# Altium project Magnetorquer.PrjPcb
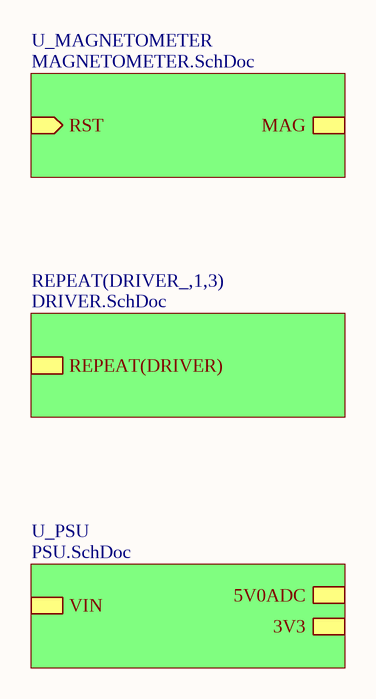
[diagram p0: TOP.SchDoc]
3 sheets, 20 parts. Net scope: hierarchical (ports join the sheet entries above them; power ports are global).
Sheets:
  TOP.SchDoc
    U_MAGNETOMETER = MAGNETOMETER.SchDoc
    DRIVER_1 = DRIVER.SchDoc
    DRIVER_2 = DRIVER.SchDoc
    DRIVER_3 = DRIVER.SchDoc

## Sheet TOP.SchDoc
size A; SheetNumber: 1; SheetTotal: 4

### Sub-sheets
REPEAT(DRIVER_,1,3) = DRIVER.SchDoc: REPEAT(DRIVER) (harness DRIVER)
U_MAGNETOMETER = MAGNETOMETER.SchDoc: RST (in), MAG (harness MAGNETOMETER)
U_PSU = PSU.SchDoc (file not in this document): VIN, 5V0ADC, 3V3

## Sheet MAGNETOMETER.SchDoc
size A; SheetNumber: 3; SheetTotal: 4
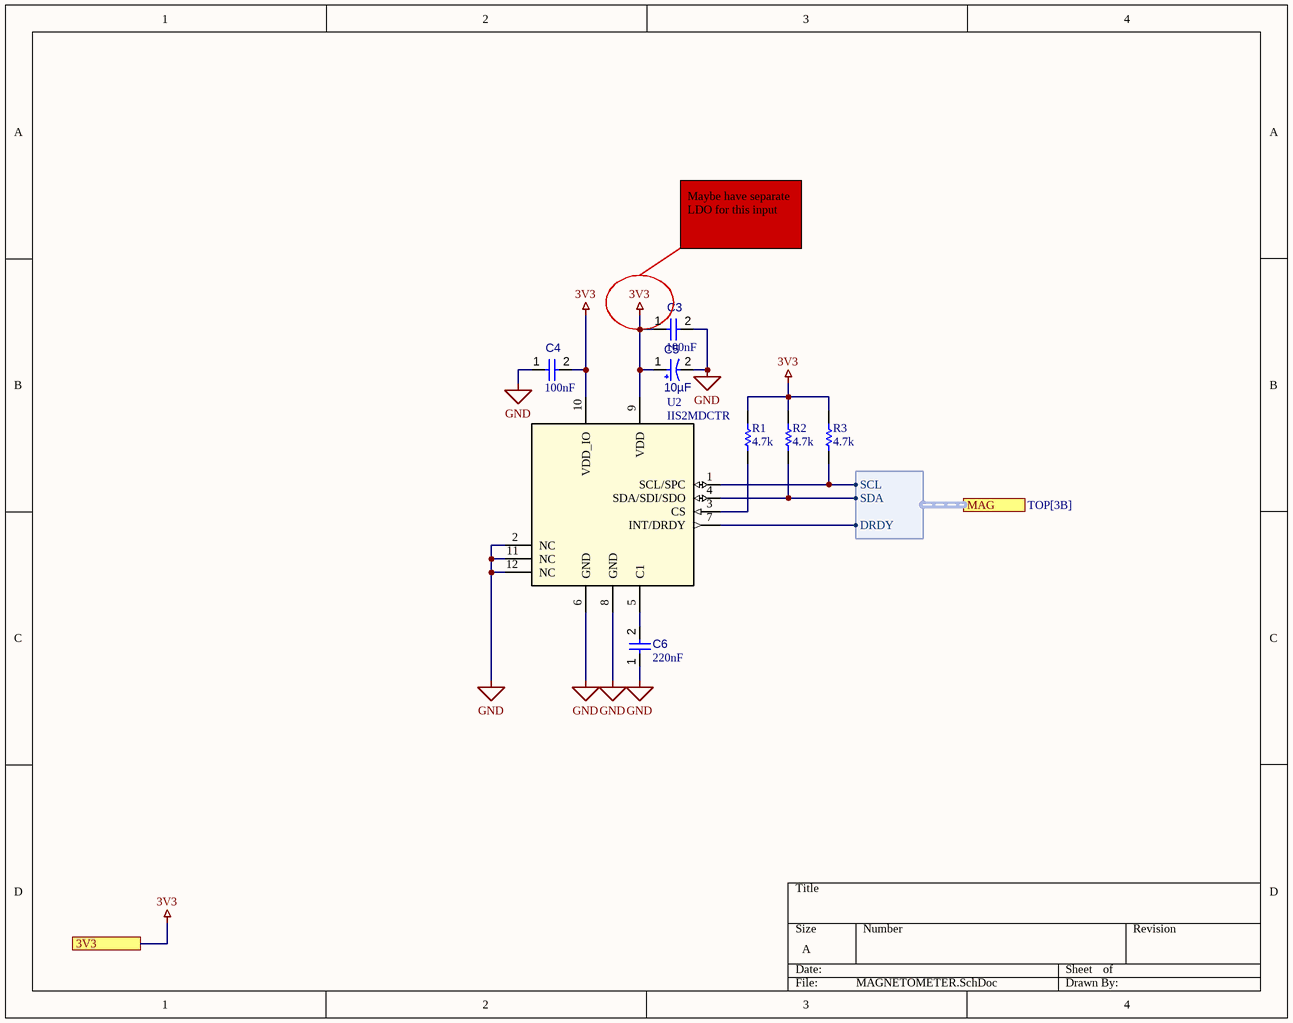
[diagram p1: MAGNETOMETER.SchDoc]

### Parts
C3  value 100nF  [CAPC1005X56X25LL10T15]  (hidden comment: Capacitor 0.1 uF +/- 5% 16 V 0402)
C4  value 100nF  [CAPC1005X56X25LL10T15]  (hidden comment: Capacitor 0.1 uF +/- 5% 16 V 0402)
C5  10µF
C6  value 220nF  [CAPC0402(1005)60_L]  (hidden comment: Capacitor 220nF +/-20% 10V 0402)
R1  value 4.7k  [RESC1005X40X25ML05T05]  (hidden comment: Resistor 4k7 +/-1% 0402 100 mW)
R2  value 4.7k  [RESC1005X40X25ML05T05]  (hidden comment: Resistor 4k7 +/-1% 0402 100 mW)
R3  value 4.7k  [RESC1005X40X25ML05T05]  (hidden comment: Resistor 4k7 +/-1% 0402 100 mW)
U2  IIS2MDCTR  [LGA-12_2X2X0P7_STM]

### Ports
3V3, MAG (harness MAGNETOMETER, see TOP[3B])

### Harnesses
MAGNETOMETER: SCL, SDA, DRDY

### Nets
3V3: C3.1 C4.2 C5.1 R1.2 R2.2 R3.2 U2.9(VDD) U2.10(VDD_IO) ; port 3V3
GND: C3.2 C4.1 C5.2 C6.1 U2.2(NC) U2.6(GND) U2.8(GND) U2.11(NC) U2.12(NC)
NetC6_2: C6.2 U2.5(C1)
NetR1_1: R1.1 U2.3(CS)
NetR2_1: R2.1 U2.4(SDA/SDI/SDO) ; port MAG.SDA
NetR3_1: R3.1 U2.1(SCL/SPC) ; port MAG.SCL
NetU2_7: U2.7(INT/DRDY) ; port MAG.DRDY

### Notes on the sheet
- Maybe have separate LDO for this input

### Library data of the parts
C3 C4 = CMP-001-00001-6: Chip Capacitor, 0.1 uF, +/- 5%, 16 V, 0402 (1005 Metric); Capacitor Type: Ceramic; Voltage Rating: 16V; Max Operating Temperature: 125°C; Min Operating Temperature: -55°C; Case/Package: 0402; Mounting Technology: SM; Pins: 2; Tolerance: 5%; RoHS Compliant: True
C5 = CMP-001-00084-3: Aluminum Electrolytic Capacitor, Polarized, Aluminum (wet), 50V, 20% +Tol, 20% -Tol, 10uF, Surface Mount, 2525; Capacitor Type: Aluminium; Ripple Current: 26mA; Max Operating Temperature: 105°C; Min Operating Temperature: -55°C; RoHS Compliant: Yes
C6 = CMP-001-00057-3: Chip Capacitor, 220nF +/-20%, 10V, 0402, Thickness 0.6 mm; Tolerance: 10%; Case/Package: 0402; Mounting Technology: SMT; Pins: 2; Max Operating Temperature: 85°C; Min Operating Temperature: -55°C; Voltage Rating: 10V
R1-R3 = CMP-009-00030-2: Chip Resistor, 4.7 KOhm, +/- 1%, 0.1 W, -55 to 155 degC, 0402 (1005 Metric); Voltage Rating: 50V; Power: 100mW; Mounting Technology: SM; Case/Package: 0402; Pins: 2; Min Operating Temperature: -55°C; RoHS Compliant: True; Tolerance: 1%; Resistance: 4.7k; Max Operating Temperature: 155°C
U2 = IIS2MDCTR: No Description Available; Mfr_Name: STMicroelectronics; Copyright: Copyright (C) 2022 Ultra Librarian. All rights reserved.; Manufacturer_Part_Number: IIS2MDCTR; RefDes: RefDes; Type: DEV

## Sheet DRIVER.SchDoc: MAGNETORQUER
size A; Author: Seth Ferrell; CompanyName: Bruin Space; SheetNumber: 2; SheetTotal: 4
Used 3 times, as channels DRIVER_1, DRIVER_2, DRIVER_3. Parts and nets are listed once, with the designators drawn on the sheet.
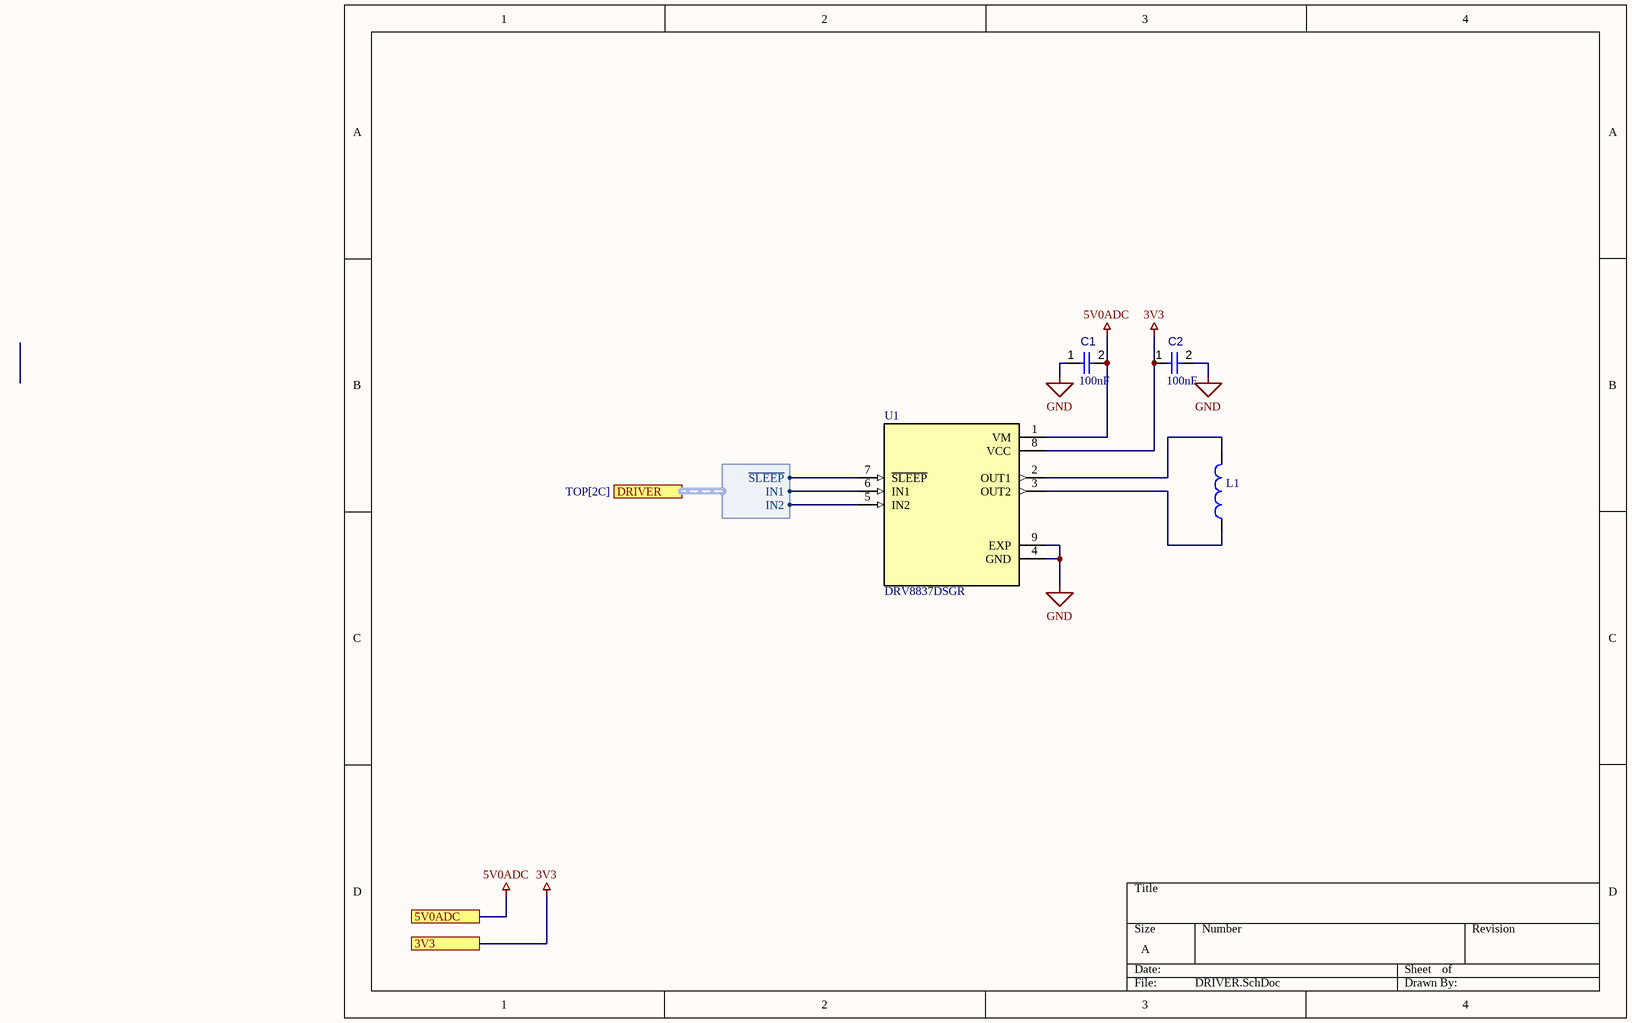
[diagram p2: DRIVER.SchDoc]

### Parts
C1  value 100nF  [CAPC1005X56X25LL10T15]  (hidden comment: Capacitor 0.1 uF +/- 5% 16 V 0402)
C2  value 100nF  [CAPC1005X56X25LL10T15]  (hidden comment: Capacitor 0.1 uF +/- 5% 16 V 0402)
L1  Inductors  (value not drawn)
U1  DRV8837DSGR  [SON50P200X200X80-9N]

### Ports
3V3, 5V0ADC, DRIVER (harness DRIVER, see TOP[2C])

### Harnesses
DRIVER: ~{SLEEP}, IN1, IN2

### Nets
3V3: C2.1 U1.8(VCC) ; port 3V3
5V0ADC: C1.2 U1.1(VM) ; port 5V0ADC
GND: C1.1 C2.2 U1.4(GND) U1.9(EXP)
NetL1_1: L1.1 U1.3(OUT2)
NetL1_2: L1.2 U1.2(OUT1)
NetU1_5: U1.5(IN2) ; port DRIVER.IN2
NetU1_6: U1.6(IN1) ; port DRIVER.IN1
NetU1_7: U1.7(~{SLEEP}) ; port DRIVER.~{SLEEP}

### Channels
DRIVER_1: designators end in _DRIVER_1; ports 3V3=3V3 5V0ADC=5V0ADC
DRIVER_2: designators end in _DRIVER_2; ports 3V3=3V3 5V0ADC=5V0ADC
DRIVER_3: designators end in _DRIVER_3; ports 3V3=3V3 5V0ADC=5V0ADC

### Library data of the parts
C1 C2 = CMP-001-00001-6: as C3 on sheet MAGNETOMETER; Max Operating Temperature: 125°C; Min Operating Temperature: -55°C; Case/Package: 0402; Mounting Technology: SM; Pins: 2; Tolerance: 5%; RoHS Compliant: True
U1 = CMP-002-000000-2: 11-V, 1.8-A H-bridge motor driver 8-WSON -40 to 85; MF: Texas Instruments; SnapEDA_Link: https://www.snapeda.com/parts/DRV8837DSGR/Texas%20Instruments/view-part/230051/?ref=snap; Component Type: Standard; BuyPart: https://www.snapeda.com/parts/DRV8837DSGR/Texas%20Instruments/view-part/230051/?ref=eda; Pin Count: 9; Source: DRV8837DSGR.SchLib; Arrow_Electronics-Purchase-URL: https://snapeda.com/shop?store=Arrow+Electronics&id=230051; Texas_Instruments-Purchase-URL: https://snapeda.com/shop?store=Texas+Instruments&id=230051; Design Item ID: DRV8837DSGR; DigiKey-Purchase-URL: https://snapeda.com/shop?store=DigiKey&id=230051; Value: *; MP: DRV8837DSGR; Package: WSON-8 Texas Instruments; Mouser-Purchase-URL: https://snapeda.com/shop?store=Mouser&id=230051; Digi-Key_Part_Number: 296-34806-1-ND
L1 = Inductors: Component Type: Inductors

## Nets that join several sheets
3V3: MAGNETOMETER (8 pins), DRIVER_1 (C2_DRIVER_1.1 U1_DRIVER_1.8), DRIVER_2 (C2_DRIVER_2.1 U1_DRIVER_2.8), DRIVER_3 (C2_DRIVER_3.1 U1_DRIVER_3.8)
5V0ADC: DRIVER_1 (C1_DRIVER_1.2 U1_DRIVER_1.1), DRIVER_2 (C1_DRIVER_2.2 U1_DRIVER_2.1), DRIVER_3 (C1_DRIVER_3.2 U1_DRIVER_3.1)
GND: MAGNETOMETER (9 pins), DRIVER_1 (C1_DRIVER_1.1 C2_DRIVER_1.2 U1_DRIVER_1.4 U1_DRIVER_1.9), DRIVER_2 (C1_DRIVER_2.1 C2_DRIVER_2.2 U1_DRIVER_2.4 U1_DRIVER_2.9), DRIVER_3 (C1_DRIVER_3.1 C2_DRIVER_3.2 U1_DRIVER_3.4 U1_DRIVER_3.9)